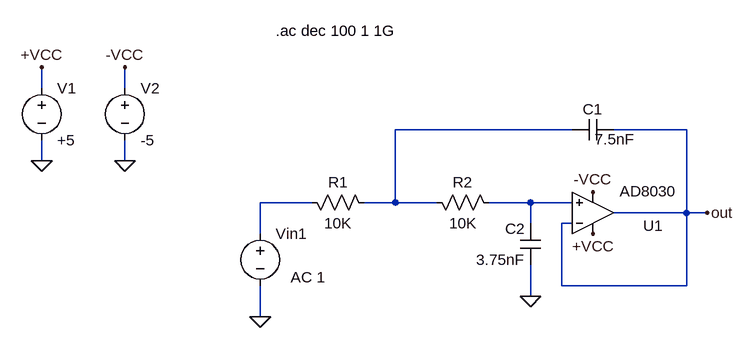
[diagram p0: schematic FTJ_Avv_BW.asc]
FTJ_Avv_BW.asc, the LTspice schematic file:
Version 4.1
SHEET 1 1112 836
WIRE -48 48 -48 16
WIRE 80 48 80 16
WIRE 768 112 496 112
WIRE 944 112 832 112
WIRE -48 160 -48 128
WIRE 80 160 80 128
WIRE 368 224 288 224
WIRE 496 224 496 112
WIRE 496 224 448 224
WIRE 560 224 496 224
WIRE 704 224 640 224
WIRE 768 224 704 224
WIRE 944 240 944 112
WIRE 944 240 832 240
WIRE 976 240 944 240
WIRE 704 256 704 224
WIRE 768 256 752 256
WIRE 288 272 288 224
WIRE 752 352 752 256
WIRE 944 352 944 240
WIRE 944 352 752 352
WIRE 704 368 704 320
WIRE 288 400 288 352
FLAG 704 368 0
FLAG 976 240 out
FLAG -48 160 0
FLAG 80 160 0
FLAG 80 16 -VCC
FLAG 800 208 -VCC
FLAG -48 16 +VCC
FLAG 800 272 +VCC
FLAG 288 400 0
SYMBOL OpAmps\\AD8030 800 304 M180
WINDOW 0 77 44 Left 2
WINDOW 3 41 97 Left 2
SYMATTR InstName U1
SYMBOL res 352 208 M90
WINDOW 0 0 56 VBottom 2
WINDOW 3 32 56 VTop 2
SYMATTR InstName R1
SYMATTR Value 10K
SYMBOL res 544 208 M90
WINDOW 0 0 56 VBottom 2
WINDOW 3 32 56 VTop 2
SYMATTR InstName R2
SYMATTR Value 10K
SYMBOL cap 832 96 R90
WINDOW 0 0 32 VBottom 2
WINDOW 3 15 -2 VTop 2
SYMATTR InstName C1
SYMATTR Value 7.5nF
SYMBOL cap 720 320 R180
WINDOW 0 24 56 Left 2
WINDOW 3 24 8 Left 2
SYMATTR InstName C2
SYMATTR Value 3.75nF
SYMBOL voltage -48 32 R0
WINDOW 123 0 0 Left 0
WINDOW 39 0 0 Left 0
SYMATTR InstName V1
SYMATTR Value +5
SYMBOL voltage 80 32 R0
WINDOW 123 0 0 Left 0
WINDOW 39 0 0 Left 0
SYMATTR InstName V2
SYMATTR Value -5
SYMBOL voltage 288 256 R0
WINDOW 3 -35 196 Left 2
WINDOW 123 47 83 Left 2
WINDOW 39 0 0 Left 0
SYMATTR Value ""
SYMATTR Value2 AC 1
SYMATTR InstName Vin1
TEXT 312 -40 Left 2 !.ac dec 100 1 1G

The netlist it stands for:
* FTJ_Avv_BW.asc
X§U1 N003 out +VCC -VCC out AD8040  ; AD8030, pins In+ In- V+ V- OUT
R1 N002 N001 10K
R2 N001 N003 10K
C1 out N001 7.5nF
C2 0 N003 3.75nF
V1 +VCC 0 +5
V2 -VCC 0 -5
Vin1 N002 0 AC 1
.ac dec 100 1 1G
.lib ADI.lib
.backanno
.end